# EAGLE design MegaFlashRom (EAGLE 5.06)
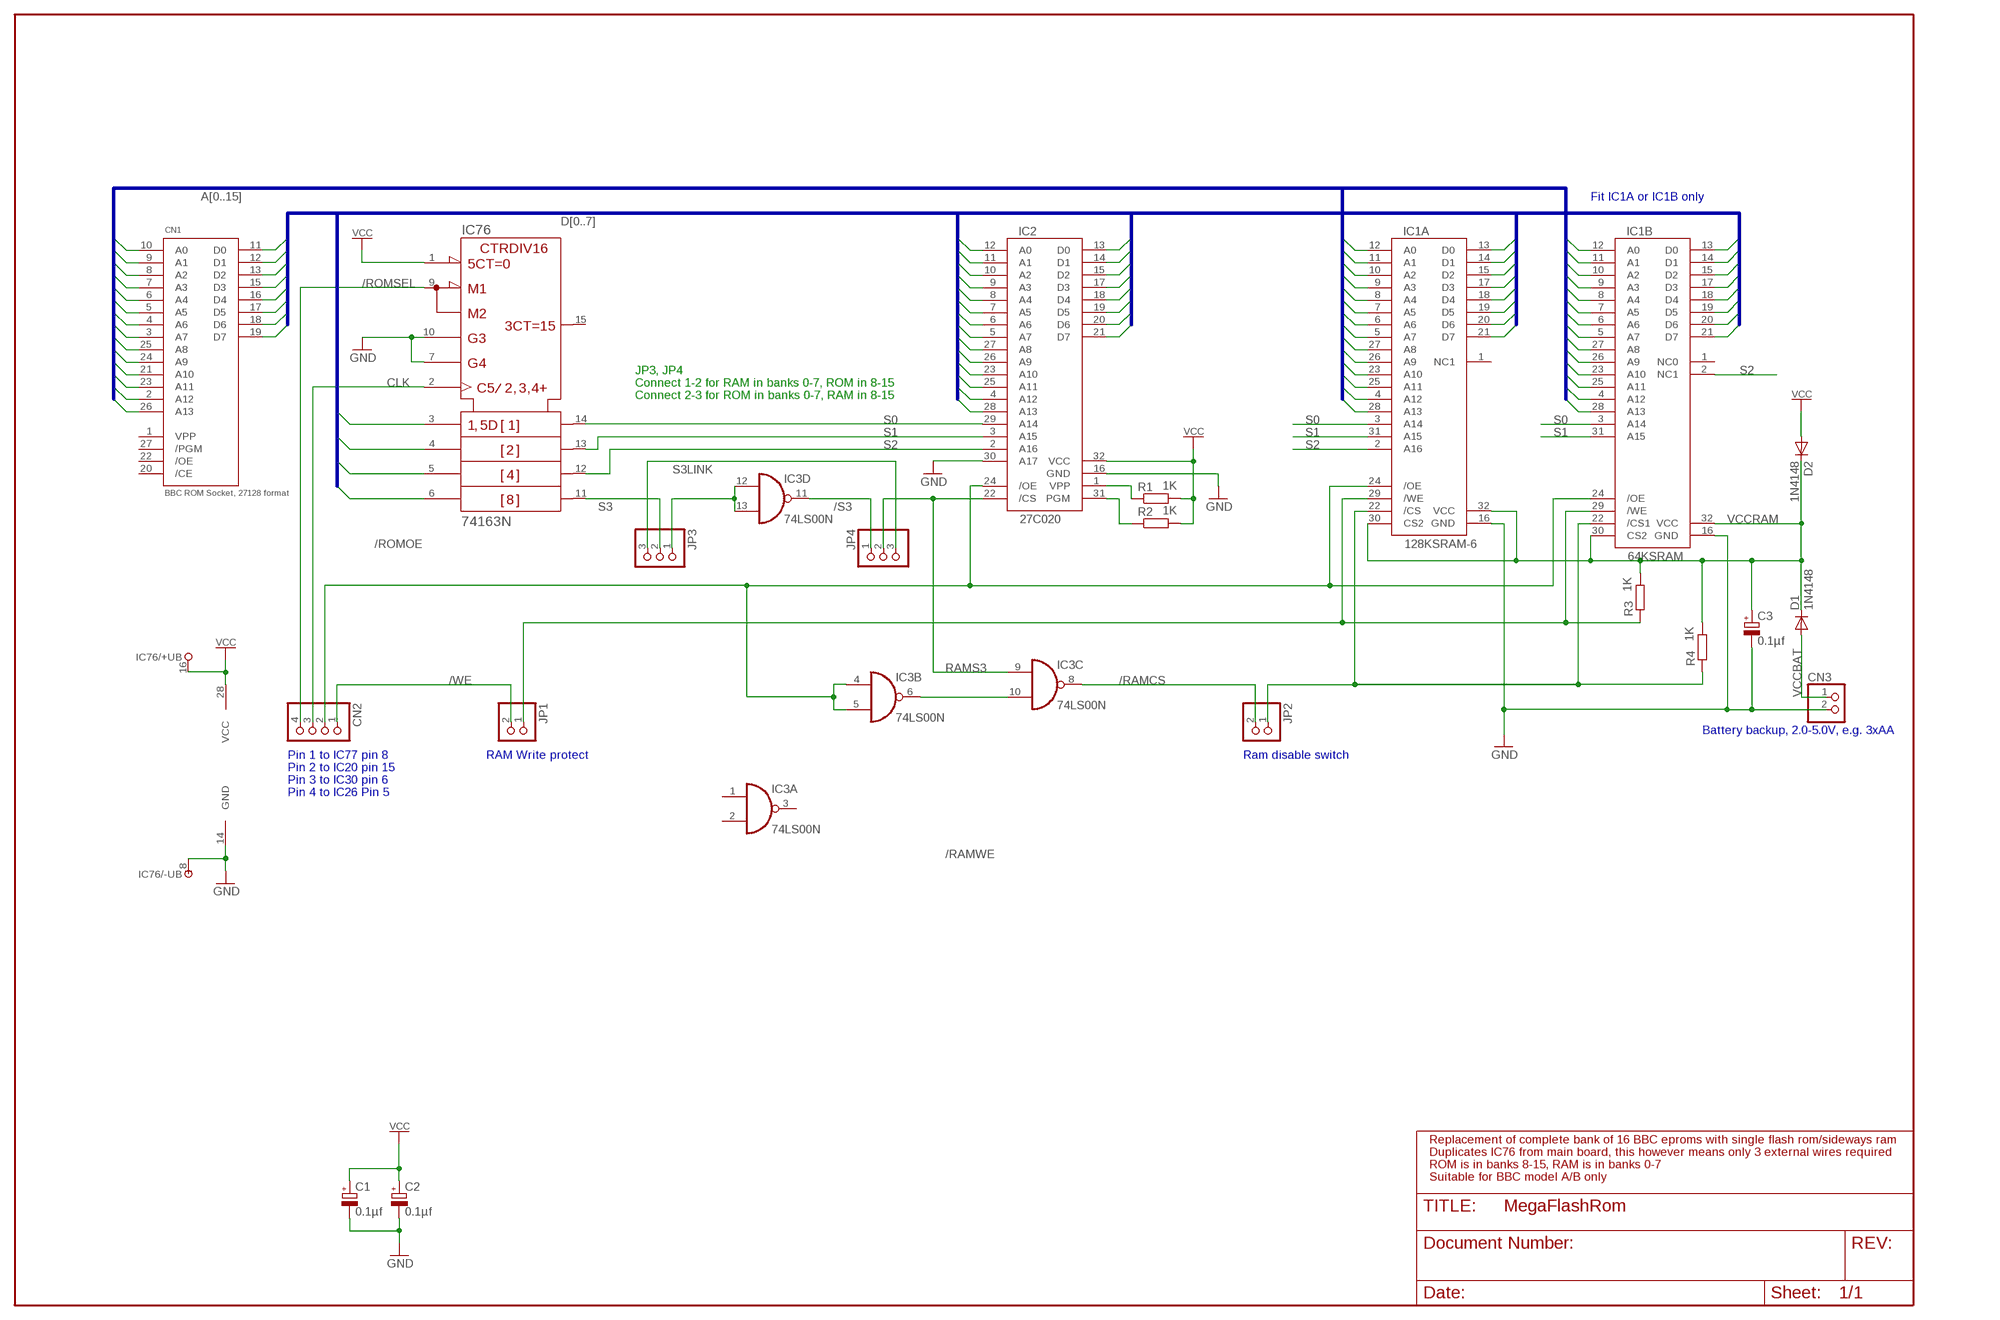
[diagram p0: schematic, sheet 1]

## Parts
C1  0.1µf  CPOL-EUB45181A  [B45181A]
C2  0.1µf  CPOL-EUB45181A  [B45181A]
C3  0.1µf  CPOL-EUB45181A  [B45181A]
CN1  BBC ROM Socket, 27128 format  27128  [DIL28]
CN2  PINHD-1X4  [1X04]
CN3  PINHD-1X2  [1X02]
D1  1N4148  [DO35-10]
D2  1N4148  [DO35-10]
IC1A  128KSRAM-6  [DIL32]
IC1B  64KSRAM  [DIL32-3]
IC2  27C020  [DIL32]
IC3  74LS00N  [DIL14]
IC76  74163N  [DIL16]
JP1  PINHD-1X2  [1X02]
JP2  PINHD-1X2  [1X02]
JP3  PINHD-1X3  [1X03]
JP4  PINHD-1X3  [1X03]
R1  1K  R-EU_0207/10  [0207/10]
R2  1K  R-EU_0207/10  [0207/10]
R3  1K  R-EU_0207/10  [0207/10]
R4  1K  R-EU_0207/10  [0207/10]

## Nets
/RAMCS: IC3.8(C:O) JP2.2
/RAMCS1: IC1A.22(/CS) IC1B.22(/CS1) JP2.1 R4.1
/RAMWE: IC1A.29(/WE) IC1B.29(/WE) JP1.1 R3.1
/ROMOE: CN2.2 IC1A.24(/OE) IC1B.24(/OE) IC2.24(/OE) IC3.4(B:I0) IC3.5(B:I1)
/ROMSEL: CN2.4 IC76.9(!LOAD)
/S3: IC3.11(D:O) JP4.1
/WE: CN2.1 JP1.2
A0: CN1.10(A0) IC1A.12(A0) IC1B.12(A0) IC2.12(A0)
A1: CN1.9(A1) IC1A.11(A1) IC1B.11(A1) IC2.11(A1)
A2: CN1.8(A2) IC1A.10(A2) IC1B.10(A2) IC2.10(A2)
A3: CN1.7(A3) IC1A.9(A3) IC1B.9(A3) IC2.9(A3)
A4: CN1.6(A4) IC1A.8(A4) IC1B.8(A4) IC2.8(A4)
A5: CN1.5(A5) IC1A.7(A5) IC1B.7(A5) IC2.7(A5)
A6: CN1.4(A6) IC1A.6(A6) IC1B.6(A6) IC2.6(A6)
A7: CN1.3(A7) IC1A.5(A7) IC1B.5(A7) IC2.5(A7)
A8: CN1.25(A8) IC1A.27(A8) IC1B.27(A8) IC2.27(A8)
A9: CN1.24(A9) IC1A.26(A9) IC1B.26(A9) IC2.26(A9)
A10: CN1.21(A10) IC1A.23(A10) IC1B.23(A10) IC2.23(A10)
A11: CN1.23(A11) IC1A.25(A11) IC1B.25(A11) IC2.25(A11)
A12: CN1.2(A12) IC1A.4(A12) IC1B.4(A12) IC2.4(A12)
A13: CN1.26(A13) IC1A.28(A13) IC1B.28(A13) IC2.28(A13)
CLK: CN2.3 IC76.2(CLK)
D0: CN1.11(D0) IC1A.13(D0) IC1B.13(D0) IC2.13(D0) IC76.3(A)
D1: CN1.12(D1) IC1A.14(D1) IC1B.14(D1) IC2.14(D1) IC76.4(B)
D2: CN1.13(D2) IC1A.15(D2) IC1B.15(D2) IC2.15(D2) IC76.5(C)
D3: CN1.15(D3) IC1A.17(D3) IC1B.17(D3) IC2.17(D3) IC76.6(D)
D4: CN1.16(D4) IC1A.18(D4) IC1B.18(D4) IC2.18(D4)
D5: CN1.17(D5) IC1A.19(D5) IC1B.19(D5) IC2.19(D5)
D6: CN1.18(D6) IC1A.20(D6) IC1B.20(D6) IC2.20(D6)
D7: CN1.19(D7) IC1A.21(D7) IC1B.21(D7) IC2.21(D7)
GND: C1.- C2.- C3.- CN1.14(GND) CN3.2 IC1A.16(GND) IC1B.16(GND) IC2.16(GND) IC2.30(A17) IC76.7(ENP) IC76.8(-UB) IC76.10(ENT)
N$3: IC3.6(B:O) IC3.10(C:I1)
N$4: IC2.1(VPP) R1.1
N$5: IC2.31(PGM) R2.1
RAMS3: IC2.22(/CS) IC3.9(C:I0) JP4.2
S0: IC1A.3(A14) IC1B.3(A14) IC2.29(A14) IC76.14(QA)
S1: IC1A.31(A15) IC1B.31(A15) IC2.3(A15) IC76.13(QB)
S2: IC1A.2(A16) IC1B.2(NC1) IC2.2(A16) IC76.12(QC)
S3: IC76.11(QD) JP3.2
S3LINK: JP3.3 JP4.3
VCC: C1.+ C2.+ CN1.28(VCC) D2.A IC2.32(VCC) IC76.1(!CLR) IC76.16(+UB) R1.2 R2.2
VCCBAT: CN3.1 D1.A
VCCRAM: C3.+ D1.C D2.C IC1A.30(CS2) IC1A.32(VCC) IC1B.30(CS2) IC1B.32(VCC) R3.2 R4.2
X2: IC3.12(D:I0) IC3.13(D:I1) JP3.1
Unconnected: CN1.1(VPP) CN1.20(/CE) CN1.22(/OE) CN1.27(/PGM) IC1A.1(NC1) IC1B.1(NC0) IC3.1(A:I0) IC3.2(A:I1) IC3.3(A:O) IC76.15(RCO)

## Buses
A[0..15]
D[0..7]

## Notes on the sheet
- Fit IC1A or IC1B only
- JP3, JP4
- Connect 1-2 for RAM in banks 0-7, ROM in 8-15
- Connect 2-3 for ROM in banks 0-7, RAM in 8-15
- Battery backup, 2.0-5.0V, e.g. 3xAA
- Pin 1 to IC77 pin 8 | RAM Write protect | Ram disable switch
- Pin 2 to IC20 pin 15
- Pin 3 to IC30 pin 6
- Pin 4 to IC26 Pin 5
- Replacement of complete bank of 16 BBC eproms with single flash rom/sideways ram
- Duplicates IC76 from main board, this however means only 3 external wires required
- ROM is in banks 8-15, RAM is in banks 0-7
- Suitable for BBC model A/B only

## Power pins joined to a net without a drawn wire
GND: IC3.7(P:GND)
VCC: IC3.14(P:VCC)

## Library data of the parts
C1-C3 = rcl:CPOL-EU: POLARIZED CAPACITOR, European symbol
CN1 = Rom-Ram:27128: 27128 or compatible EPROM
CN2 = pinhead:PINHD-1X4: PIN HEADER
CN3 JP1 JP2 = pinhead:PINHD-1X2: PIN HEADER
D1 D2 = diode:1N4148: DIODE high speed (Philips)
IC1A = Rom-Ram:128KSRAM-6
IC1B = Rom-Ram:64KSRAM: Standard pinout 64K x 8 bit static RAM
IC2 = Rom-Ram:27C020
IC3 = 74xx-eu:74*00: Quad 2-input NAND gate
IC76 = 74ttl-din:74*163: Synchrounus 4-bit COUNTER
JP3 JP4 = pinhead:PINHD-1X3: PIN HEADER
R1-R4 = rcl:R-EU_: RESISTOR, European symbol

## Board
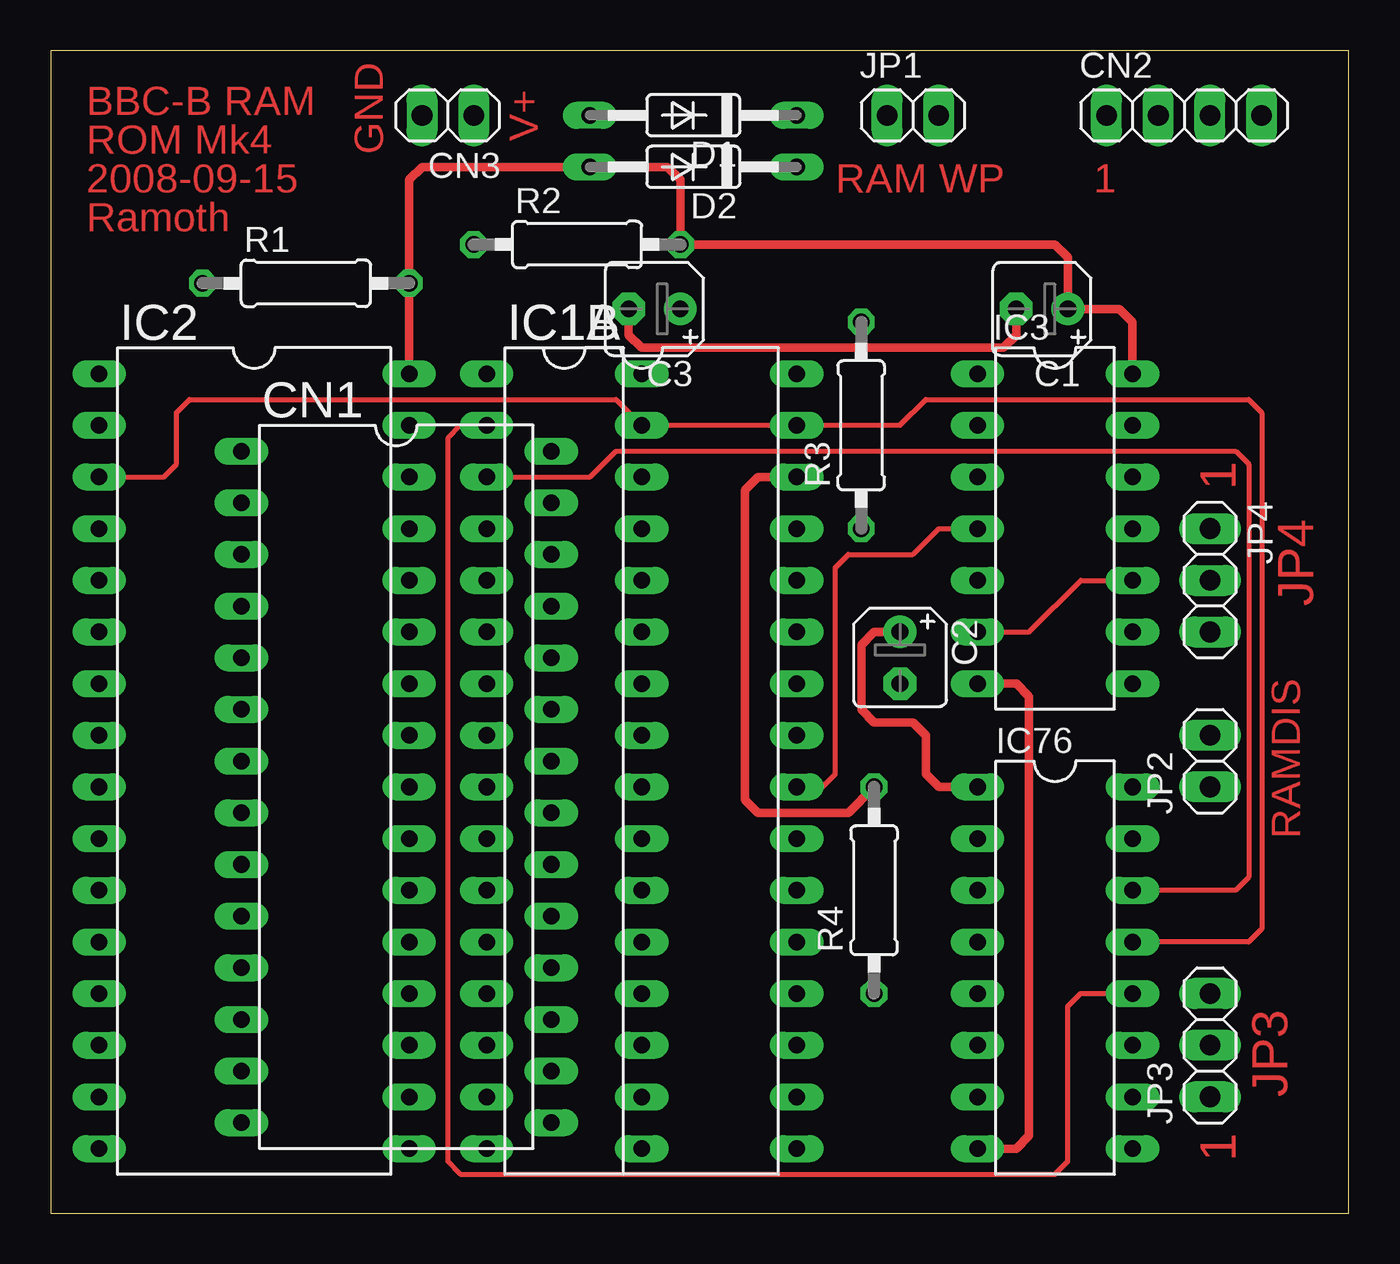
[diagram p1: board, top side]
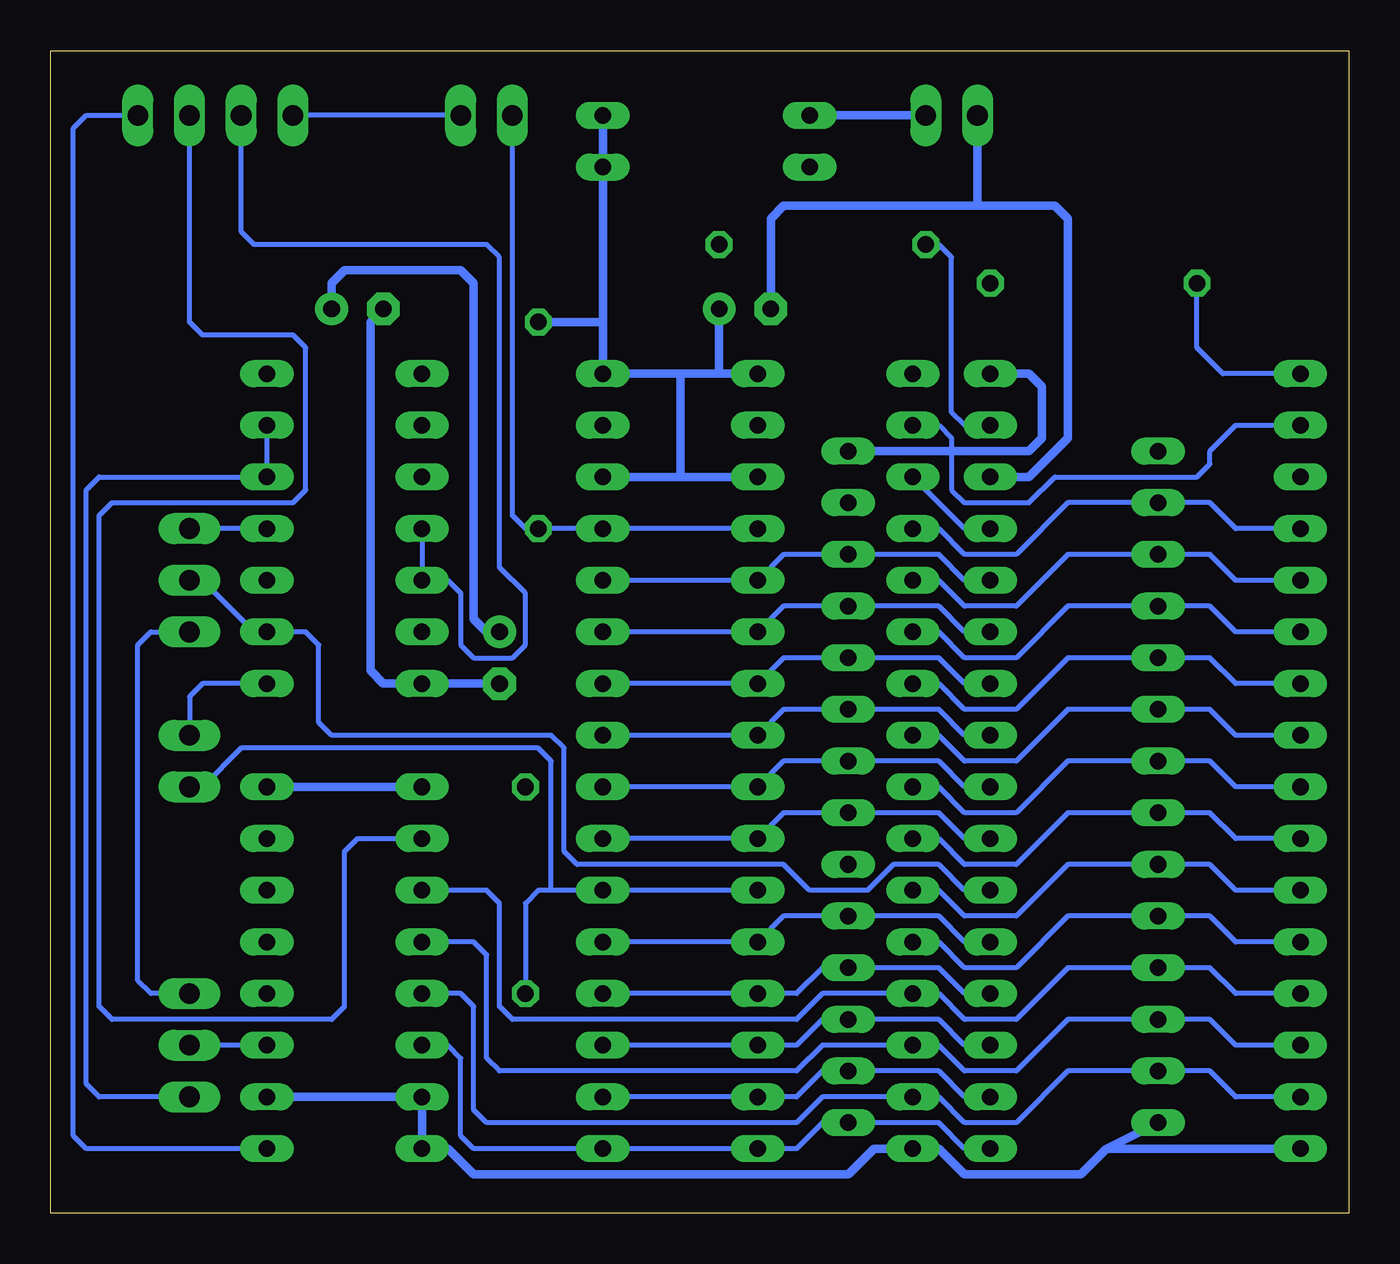
[diagram p2: board, bottom side, seen from below]

Size 63.8 x 57.14 mm. Coordinates in mm from the lower left corner, seen from the top.
Outline: 0,0 63.8,0 63.8,57.14 0,57.14 0,0
Copper layers (1*16): Top 0.035mm / dielectric 1.5mm / Bottom 0.035mm
Design rules "default": minimum track width 10mil, minimum drill 24mil, track to track 8mil, track to pad 8mil, pad to pad 8mil, via to via 8mil, smd to smd 8mil, copper to edge 40mil, drill to drill 8mil, minimum pad ring 10mil, minimum via ring 8mil, stop-mask expansion 4mil, vias tented up to drill 0mil, thermal gap 10mil

### Footprints (pad centres in the part's own frame; a part is rotated, then mirrored left to right if it is on the bottom)
B45181A = drill 0.813 pad 1.6 round: + -1.27,0 | drill 0.813 pad 1.6 octagon: - 1.27,0
DIL28 = drill 0.813 long: 1 -16.51,-7.62; 2 -13.97,-7.62; 3 -11.43,-7.62; 4 -8.89,-7.62; 5 -6.35,-7.62; 6 -3.81,-7.62; 7 -1.27,-7.62; 8 1.27,-7.62; 9 3.81,-7.62; 10 6.35,-7.62; 11 8.89,-7.62; 12 11.43,-7.62; 13 13.97,-7.62; 14 16.51,-7.62; 15 16.51,7.62; 16 13.97,7.62; 17 11.43,7.62; 18 8.89,7.62; 19 6.35,7.62; 20 3.81,7.62; 21 1.27,7.62; 22 -1.27,7.62; 23 -3.81,7.62; 24 -6.35,7.62; 25 -8.89,7.62; 26 -11.43,7.62; 27 -13.97,7.62; 28 -16.51,7.62
1X04 = drill 1.016 long: 1 -3.81,0; 2 -1.27,0; 3 1.27,0; 4 3.81,0
1X02 = drill 1.016 long: 1 -1.27,0; 2 1.27,0
DO35-10 = drill 0.813 long: A 5.08,0; C -5.08,0
DIL32 = drill 0.813 long: 1 -19.05,-7.62; 2 -16.51,-7.62; 3 -13.97,-7.62; 4 -11.43,-7.62; 5 -8.89,-7.62; 6 -6.35,-7.62; 7 -3.81,-7.62; 8 -1.27,-7.62; 9 1.27,-7.62; 10 3.81,-7.62; 11 6.35,-7.62; 12 8.89,-7.62; 13 11.43,-7.62; 14 13.97,-7.62; 15 16.51,-7.62; 16 19.05,-7.62; 17 19.05,7.62; 18 16.51,7.62; 19 13.97,7.62; 20 11.43,7.62; 21 8.89,7.62; 22 6.35,7.62; 23 3.81,7.62; 24 1.27,7.62; 25 -1.27,7.62; 26 -3.81,7.62; 27 -6.35,7.62; 28 -8.89,7.62; 29 -11.43,7.62; 30 -13.97,7.62; 31 -16.51,7.62; 32 -19.05,7.62
DIL32-3 = drill 0.813 long: 1 -19.05,-8.89; 2 -16.51,-8.89; 3 -13.97,-8.89; 4 -11.43,-8.89; 5 -8.89,-8.89; 6 -6.35,-8.89; 7 -3.81,-8.89; 8 -1.27,-8.89; 9 1.27,-8.89; 10 3.81,-8.89; 11 6.35,-8.89; 12 8.89,-8.89; 13 11.43,-8.89; 14 13.97,-8.89; 15 16.51,-8.89; 16 19.05,-8.89; 17 19.05,-1.27; 18 16.51,-1.27; 19 13.97,-1.27; 20 11.43,-1.27; 21 8.89,-1.27; 22 6.35,-1.27; 23 3.81,-1.27; 24 1.27,-1.27; 25 -1.27,-1.27; 26 -3.81,-1.27; 27 -6.35,-1.27; 28 -8.89,-1.27; 29 -11.43,-1.27; 30 -13.97,-1.27; 31 -16.51,-1.27; 32 -19.05,-1.27
DIL14 = drill 0.813 long: 1 -7.62,-3.81; 2 -5.08,-3.81; 3 -2.54,-3.81; 4 0,-3.81; 5 2.54,-3.81; 6 5.08,-3.81; 7 7.62,-3.81; 8 7.62,3.81; 9 5.08,3.81; 10 2.54,3.81; 11 0,3.81; 12 -2.54,3.81; 13 -5.08,3.81; 14 -7.62,3.81
DIL16 = drill 0.813 long: 1 -8.89,-3.81; 2 -6.35,-3.81; 3 -3.81,-3.81; 4 -1.27,-3.81; 5 1.27,-3.81; 6 3.81,-3.81; 7 6.35,-3.81; 8 8.89,-3.81; 9 8.89,3.81; 10 6.35,3.81; 11 3.81,3.81; 12 1.27,3.81; 13 -1.27,3.81; 14 -3.81,3.81; 15 -6.35,3.81; 16 -8.89,3.81
1X03 = drill 1.016 long: 1 -2.54,0; 2 0,0; 3 2.54,0
0207/10 = drill 0.813 octagon: 1 -5.08,0; 2 5.08,0

### Placement (x,y rotation side)
C1  48.73,44.45 180 top
C2  41.74,27.3 270 top
C3  29.68,44.45 180 top
CN1  16.98,20.95 270 top
CN2  55.71,53.97 0 top
CN3  19.52,53.97 180 top
D1  31.58,53.97 180 top
D2  31.58,51.43 180 top
IC1A  29.04,22.22 270 top
IC1B  30.31,22.22 270 top
IC2  10,22.22 270 top
IC3  49.37,33.65 270 top
IC76  49.37,12.06 270 top
JP1  42.38,53.97 0 top
JP2  56.98,22.22 90 top
JP3  56.98,8.25 90 top
JP4  56.98,31.11 270 top
R1  12.54,45.72 0 top
R2  25.87,47.62 0 top
R3  39.84,38.73 90 top
R4  40.48,15.87 90 top

### Tracks (layer width: path | path; a pad name or v marks a point on that pad's centre or on a via)
/RAMCS
  Bottom 0.254: IC3.8 56.35,26.03 56.98,25.39 JP2.2
/RAMCS1
  Bottom 0.254: 39.2,15.87 IC1A.22 IC1B.22 | 39.2,15.87 39.2,22.22 39.84,22.86 54.45,22.86 56.35,20.95 JP2.1 | R4.1 40.48,15.24 39.84,15.87 39.2,15.87
/RAMWE
  Bottom 0.254: IC1B.29 IC1A.29 R3.1 40.48,33.65 41.11,34.29 JP1.1
/ROMOE
  Top 0.254: IC1A.24 37.94,20.95 38.57,21.58 38.57,31.74 39.2,32.38 42.38,32.38 43.65,33.65 IC3.4
  Bottom 0.254: CN2.2 54.45,48.26 53.81,47.62 42.38,47.62 41.74,46.98 41.74,31.74 40.48,30.47 40.48,27.93 41.11,27.3 43.02,27.3 43.65,27.93 43.65,30.47 44.28,31.11 IC3.5 IC3.4 | IC1A.24 IC1B.24 27.77,22.22 20.15,22.22 18.88,20.95 IC2.24
/ROMSEL
  Bottom 0.254: CN2.4 62.06,53.97 62.7,53.34 62.7,3.8 62.06,3.17 IC76.9
/S3
  Bottom 0.254: IC3.11 JP4.1
/WE
  Bottom 0.254: JP1.2 CN2.1
A0
  Bottom 0.254: IC2.12 5.55,13.33 6.82,14.6 CN1.10 13.81,14.6 16.34,12.06 18.88,12.06 20.15,13.33 IC1B.12
A1
  Bottom 0.254: IC2.11 5.55,15.87 6.82,17.14 CN1.9 13.81,17.14 16.34,14.6 18.88,14.6 20.15,15.87 IC1B.11
A2
  Bottom 0.254: IC2.10 5.55,18.41 6.82,19.68 CN1.8 13.81,19.68 16.34,17.14 18.88,17.14 20.15,18.41 IC1B.10
A3
  Bottom 0.254: IC2.9 5.55,20.95 6.82,22.22 CN1.7 13.81,22.22 16.34,19.68 18.88,19.68 20.15,20.95 IC1B.9
A4
  Bottom 0.254: IC2.8 5.55,23.49 6.82,24.76 CN1.6 13.81,24.76 16.34,22.22 18.88,22.22 20.15,23.49 IC1B.8
A5
  Bottom 0.254: IC2.7 5.55,26.03 6.82,27.3 CN1.5 13.81,27.3 16.34,24.76 18.88,24.76 20.15,26.03 IC1B.7
A6
  Bottom 0.254: IC2.6 5.55,28.57 6.82,29.84 CN1.4 13.81,29.84 16.34,27.3 18.88,27.3 20.15,28.57 IC1B.6
A7
  Bottom 0.254: IC2.5 5.55,31.11 6.82,32.38 CN1.3 13.81,32.38 16.34,29.84 18.88,29.84 20.15,31.11 IC1B.5
A8
  Bottom 0.254: IC2.27 18.88,28.57 20.15,29.84 CN1.25 27.77,29.84 IC1B.27 IC1A.27
A9
  Bottom 0.254: IC2.26 18.88,26.03 20.15,27.3 CN1.24 27.77,27.3 IC1B.26 IC1A.26
A10
  Bottom 0.254: IC2.23 18.88,18.41 20.15,19.68 CN1.21 27.77,19.68 IC1B.23 IC1A.23
A11
  Bottom 0.254: IC2.25 18.88,23.49 20.15,24.76 CN1.23 27.77,24.76 IC1B.25 IC1A.25
A12
  Bottom 0.254: IC2.4 5.55,33.65 6.82,34.92 CN1.2 13.81,34.92 16.34,32.38 18.88,32.38 20.15,33.65 IC1B.4
A13
  Bottom 0.254: 18.25,31.11 IC2.28 18.88,31.11 20.15,32.38 CN1.26 27.77,32.38 IC1B.28 IC1A.28
CLK
  Bottom 0.254: IC76.2 48.73,18.41 49.37,17.77 49.37,10.16 50,9.52 60.8,9.52 61.43,10.16 61.43,34.29 60.8,34.92 51.91,34.92 51.27,35.55 51.27,42.54 51.91,43.18 56.35,43.18 56.98,43.81 CN2.3
D0
  Bottom 0.254: IC2.13 5.55,10.79 6.82,12.06 CN1.11 13.81,12.06 16.34,9.52 18.88,9.52 20.15,10.79 IC1B.13 25.87,10.79 27.14,9.52 41.11,9.52 41.74,10.16 41.74,15.24 42.38,15.87 IC76.3
D1
  Bottom 0.254: IC2.14 5.55,8.25 6.82,9.52 CN1.12 13.81,9.52 16.34,6.98 18.88,6.98 20.15,8.25 IC1B.14 25.87,8.25 27.14,6.98 41.74,6.98 42.38,7.62 42.38,12.7 43.02,13.33 IC76.4
D2
  Bottom 0.254: IC2.15 5.55,5.71 6.82,6.98 CN1.13 13.81,6.98 16.34,4.44 18.88,4.44 20.15,5.71 IC1B.15 25.87,5.71 27.14,4.44 42.38,4.44 43.02,5.08 43.02,10.16 43.65,10.79 IC76.5
D3
  Bottom 0.254: IC2.17 18.88,3.17 20.15,4.44 CN1.15 25.87,4.44 27.14,3.17 IC1B.17 IC1A.17 43.02,3.17 43.65,3.8 43.65,7.62 44.28,8.25 IC76.6
D4
  Bottom 0.254: IC2.18 18.88,5.71 20.15,6.98 CN1.16 25.87,6.98 27.14,5.71 IC1B.18 IC1A.18
D5
  Bottom 0.254: IC2.19 18.88,8.25 20.15,9.52 CN1.17 25.87,9.52 27.14,8.25 IC1B.19 IC1A.19
D6
  Bottom 0.254: IC2.20 18.88,10.79 20.15,12.06 CN1.18 25.87,12.06 27.14,10.79 IC1B.20 IC1A.20
D7
  Bottom 0.254: IC2.21 18.88,13.33 20.15,14.6 CN1.19 27.77,14.6 IC1B.21 IC1A.21
GND
  Top 0.406: IC3.7 47.46,26.03 48.09,25.39 48.09,3.8 47.46,3.17 IC76.8 | C1.- 47.46,43.18 46.82,42.54 29.04,42.54 28.41,43.18 C3.-
  Bottom 0.406: IC2.16 11.9,3.17 | 11.9,3.17 13.17,1.9 18.88,1.9 20.15,3.17 IC1B.16 23.33,3.17 24.6,1.9 43.02,1.9 44.28,3.17 IC76.8 IC76.7 IC76.10 | C1.- 48.09,43.81 48.09,26.66 47.46,26.03 IC3.7 C2.- | 11.9,3.17 CN1.14 | IC2.30 15.71,36.19 13.81,38.1 13.81,48.89 14.44,49.53 18.25,49.53 | 18.25,49.53 27.77,49.53 28.41,48.89 C3.- | 18.25,49.53 CN3.2
N$3
  Top 0.254: IC3.6 48.09,28.57 50.63,31.11 IC3.10
N$4
  Bottom 0.254: IC2.1 6.18,41.27 7.46,42.54 R1.1
N$5
  Bottom 0.254: IC2.31 18.88,38.73 19.52,39.37 19.52,46.98 20.15,47.62 R2.1
RAMS3
  Bottom 0.254: IC2.22 18.88,15.87 20.15,17.14 22.38,17.14 23.65,15.87 26.5,15.87 27.77,17.14 37.94,17.14 38.57,17.77 38.57,22.86 39.2,23.49 50,23.49 50.63,24.12 50.63,27.93 51.27,28.57 IC3.9 53.81,28.57 56.35,31.11 JP4.2
S0
  Top 0.254: IC76.14 58.25,15.87 58.89,16.5 58.89,36.83 58.25,37.46 27.77,37.46 26.5,36.19 IC1B.3
  Bottom 0.254: IC2.29 18.88,33.65 IC1B.3
S1
  Top 0.254: IC2.3 5.55,36.19 6.18,36.83 6.18,39.37 6.82,40 27.77,40 IC1B.31 IC1A.31 41.74,38.73 43.02,40 58.89,40 59.52,39.37 59.52,13.97 58.89,13.33 IC76.13
S2
  Top 0.254: IC1B.2 20.15,38.73 19.52,38.1 19.52,2.54 20.15,1.9 49.37,1.9 50,2.54 50,10.16 50.63,10.79 IC76.12
  Bottom 0.254: IC2.2 5.55,38.73 6.82,37.46 6.82,36.83 7.46,36.19 14.44,36.19 15.71,34.92 18.88,34.92 19.52,35.55 19.52,38.1 20.15,38.73 IC1B.2
S3
  Bottom 0.254: IC76.11 JP3.2
S3LINK
  Bottom 0.254: JP4.3 58.89,28.57 59.52,27.93 59.52,11.43 58.89,10.79 JP3.3
VCC
  Top 0.406: IC2.32 R1.2 17.61,50.8 18.25,51.43 D2.A 30.31,51.43 30.95,50.8 R2.2 39.84,47.62 49.37,47.62 50,46.98 C1.+ 52.54,44.45 53.17,43.81 IC3.14 | IC76.1 43.65,20.95 43.02,21.58 43.02,23.49 42.38,24.12 40.48,24.12 39.84,24.76 39.84,27.93 40.48,28.57 C2.+
  Bottom 0.406: IC76.1 IC76.16 | CN1.28 15.71,37.46 15.08,38.1 15.08,40.64 15.71,41.27 IC2.32 | C2.+ 42.38,28.57 43.02,29.2 43.02,45.72 43.65,46.35 49.37,46.35 50,45.72 C1.+
VCCBAT
  Bottom 0.406: CN3.1 D1.A
VCCRAM
  Top 0.406: R4.2 39.2,19.68 34.76,19.68 34.12,20.31 34.12,35.55 34.76,36.19 IC1A.30
  Bottom 0.406: 32.85,41.27 30.95,41.27 | 30.95,41.27 IC1B.32 | 32.85,41.27 IC1A.32 36.66,43.81 | IC1A.30 32.85,36.19 | 32.85,36.19 IC1B.30 | 32.85,36.19 32.85,41.27 | D1.C D2.C 36.66,43.81 | 36.66,43.81 R3.2 | 30.95,41.27 C3.+
X2
  Bottom 0.254: IC3.13 IC3.12 61.43,36.19 62.06,35.55 62.06,6.34 61.43,5.71 JP3.1

### Text on the board
Top: BBC-B RAM | V+ | ROM Mk4 | GND | 2008-09-15 | RAM WP | 1 | Ramoth | 1 | JP4 | RAMDIS | JP3 | 1